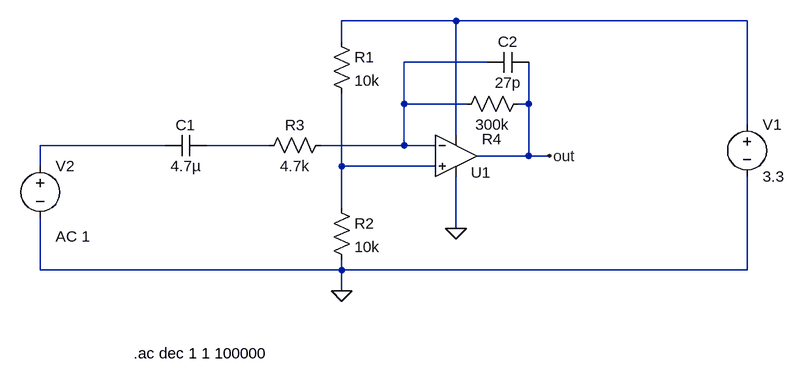
[diagram p0: schematic bandpass.asc]
bandpass.asc, the LTspice schematic file:
Version 4.1
SHEET 1 880 680
WIRE 224 -48 48 -48
WIRE 672 -48 224 -48
WIRE 48 -16 48 -48
WIRE 272 16 144 16
WIRE 144 80 144 16
WIRE 240 80 144 80
WIRE 336 80 336 16
WIRE 336 80 320 80
WIRE 672 112 672 -48
WIRE 224 128 224 -48
WIRE -224 144 -416 144
WIRE -64 144 -160 144
WIRE 144 144 144 80
WIRE 144 144 16 144
WIRE 192 144 144 144
WIRE 336 160 336 80
WIRE 336 160 256 160
WIRE 368 160 336 160
WIRE -416 176 -416 144
WIRE 48 176 48 64
WIRE 192 176 48 176
WIRE 48 240 48 176
WIRE 224 272 224 192
WIRE -416 336 -416 256
WIRE 48 336 48 320
WIRE 48 336 -416 336
WIRE 672 336 672 192
WIRE 672 336 48 336
WIRE 48 368 48 336
FLAG 224 272 0
FLAG 368 160 out
FLAG 48 368 0
SYMBOL OpAmps\\UniversalOpAmp 224 160 R0
WINDOW 0 23 26 Left 2
SYMATTR InstName U1
SYMBOL res 32 -32 R0
SYMATTR InstName R1
SYMATTR Value 10k
SYMBOL res 32 224 R0
SYMATTR InstName R2
SYMATTR Value 10k
SYMBOL voltage 672 96 R0
WINDOW 123 0 0 Left 0
WINDOW 39 0 0 Left 0
SYMATTR InstName V1
SYMATTR Value 3.3
SYMBOL cap -160 128 R90
WINDOW 0 0 32 VBottom 2
WINDOW 3 32 32 VTop 2
SYMATTR InstName C1
SYMATTR Value 4.7µ
SYMBOL cap 336 0 R90
WINDOW 0 0 32 VBottom 2
WINDOW 3 32 32 VTop 2
SYMATTR InstName C2
SYMATTR Value 27p
SYMBOL res 32 128 R90
WINDOW 0 0 56 VBottom 2
WINDOW 3 32 56 VTop 2
SYMATTR InstName R3
SYMATTR Value 4.7k
SYMBOL res 336 64 R90
WINDOW 0 86 57 VBottom 2
WINDOW 3 32 56 VTop 2
SYMATTR InstName R4
SYMATTR Value 300k
SYMBOL voltage -416 160 R0
WINDOW 123 24 124 Left 2
WINDOW 39 0 0 Left 0
SYMATTR Value2 AC 1
SYMATTR InstName V2
SYMATTR Value ""
TEXT -272 464 Left 2 !.ac dec 1 1 100000

The netlist it stands for:
* bandpass.asc
X§U1 N005 N002 N001 0 out level1 Avol=1Meg GBW=10Meg Vos=0 En=0 Enk=0 In=0 Ink=0 Rin=500Meg  ; pins In+ In- V+ V- OUT
R1 N001 N005 10k
R2 N005 0 10k
V1 N001 0 3.3
C1 N004 N003 4.7µ
C2 out N002 27p
R3 N002 N004 4.7k
R4 out N002 300k
V2 N003 0 AC 1
.ac dec 1 1 100000
.lib UniversalOpAmp1.lib
.backanno
.end